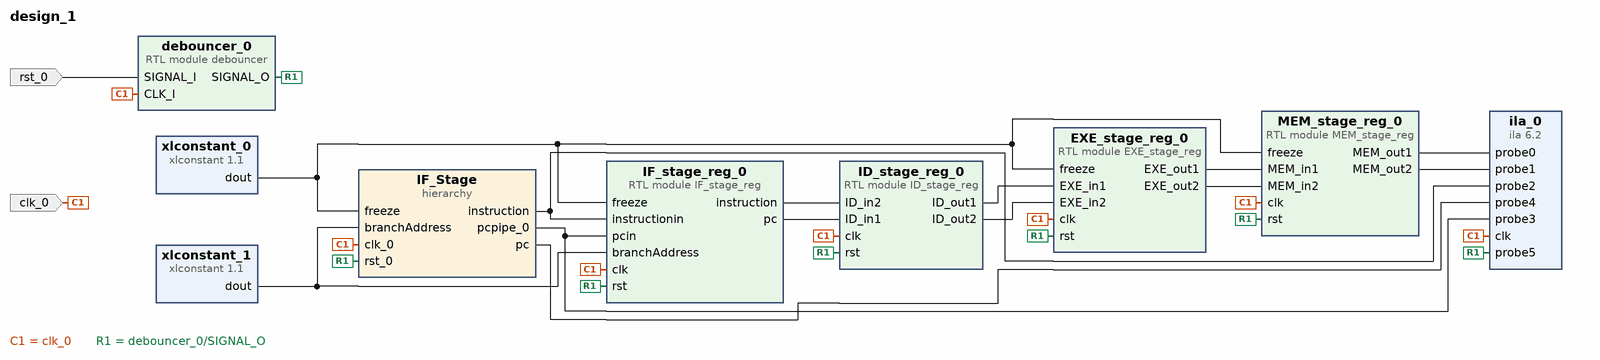
[diagram p0: block diagram of the top level]
# Vivado block design design_1, xc7z010clg400-1, Vivado 2018.3
create_bd_design design_1

create_bd_port -dir I -type clk clk_0
create_bd_port -dir I -type rst rst_0

create_bd_cell -type ip -vlnv xilinx.com:ip:xlconstant:1.1 xlconstant_0
set_property -dict {CONFIG.CONST_VAL 0} [get_bd_cells xlconstant_0]
create_bd_cell -type ip -vlnv xilinx.com:ip:xlconstant:1.1 xlconstant_1
set_property -dict {CONFIG.CONST_VAL 0 CONFIG.CONST_WIDTH 32} [get_bd_cells xlconstant_1]
create_bd_cell -type module -reference IF_stage_reg IF_stage_reg_0
create_bd_cell -type hier IF_Stage
create_bd_cell -type module -reference ID_stage_reg ID_stage_reg_0
create_bd_cell -type module -reference EXE_stage_reg EXE_stage_reg_0
create_bd_cell -type module -reference MEM_stage_reg MEM_stage_reg_0
create_bd_cell -type ip -vlnv xilinx.com:ip:ila:6.2 ila_0
set_property -dict [list \
  CONFIG.C_ENABLE_ILA_AXI_MON false \
  CONFIG.C_MONITOR_TYPE Native \
  CONFIG.C_NUM_OF_PROBES 6 \
  CONFIG.C_PROBE0_TYPE 1 \
  CONFIG.C_PROBE0_WIDTH 32 \
  CONFIG.C_PROBE1_TYPE 1 \
  CONFIG.C_PROBE1_WIDTH 32 \
  CONFIG.C_PROBE2_TYPE 1 \
  CONFIG.C_PROBE2_WIDTH 32 \
  CONFIG.C_PROBE3_TYPE 1 \
  CONFIG.C_PROBE3_WIDTH 32 \
  CONFIG.C_PROBE4_TYPE 1 \
  CONFIG.C_PROBE4_WIDTH 32 \
  CONFIG.C_PROBE5_TYPE 2 \
] [get_bd_cells ila_0]
create_bd_cell -type module -reference debouncer debouncer_0

# ---- hierarchy /IF_Stage ----
current_bd_instance /IF_Stage
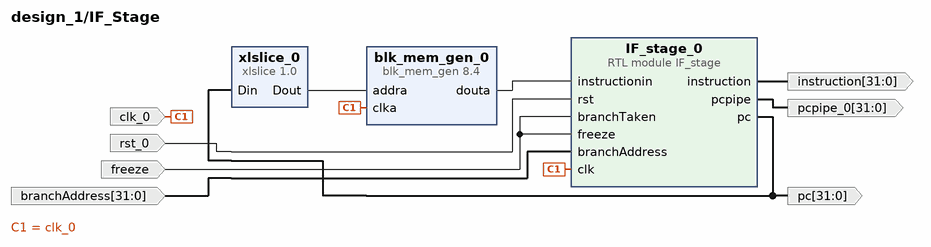
[diagram p1: block diagram inside /IF_Stage]
create_bd_pin -dir O -from 31 -to 0 pc
create_bd_pin -dir I -type clk clk_0
create_bd_pin -dir I -type rst rst_0
create_bd_pin -dir I freeze
create_bd_pin -dir I -from 31 -to 0 branchAddress
create_bd_pin -dir O -from 31 -to 0 instruction
create_bd_pin -dir O -from 31 -to 0 pcpipe_0

create_bd_cell -type ip -vlnv xilinx.com:ip:xlslice:1.0 xlslice_0
set_property -dict {CONFIG.DIN_FROM 12 CONFIG.DOUT_WIDTH 13} [get_bd_cells xlslice_0]
create_bd_cell -type ip -vlnv xilinx.com:ip:blk_mem_gen:8.4 blk_mem_gen_0
set_property -dict [list \
  CONFIG.Coe_File ../../../../../../../output.coe \
  CONFIG.Enable_32bit_Address false \
  CONFIG.Enable_A Always_Enabled \
  CONFIG.Fill_Remaining_Memory_Locations true \
  CONFIG.Load_Init_File true \
  CONFIG.Memory_Type Single_Port_ROM \
  CONFIG.Port_A_Write_Rate 0 \
  CONFIG.Register_PortA_Output_of_Memory_Primitives true \
  CONFIG.Remaining_Memory_Locations FABC \
  CONFIG.Use_RSTA_Pin false \
  CONFIG.use_bram_block Stand_Alone \
] [get_bd_cells blk_mem_gen_0]
create_bd_cell -type module -reference IF_stage IF_stage_0

# ---- connections ----

current_bd_instance /IF_Stage
connect_bd_net [get_bd_pins xlslice_0/Dout] [get_bd_pins blk_mem_gen_0/addra]
connect_bd_net [get_bd_pins IF_stage_0/pc] [get_bd_pins pc] [get_bd_pins xlslice_0/Din]
connect_bd_net -net clk_0_1 [get_bd_pins clk_0] [get_bd_pins blk_mem_gen_0/clka] [get_bd_pins IF_stage_0/clk]
connect_bd_net -net rst_0_1 [get_bd_pins rst_0] [get_bd_pins IF_stage_0/rst]
connect_bd_net -net xlconstant_0_dout [get_bd_pins freeze] [get_bd_pins IF_stage_0/branchTaken] [get_bd_pins IF_stage_0/freeze]
connect_bd_net [get_bd_pins blk_mem_gen_0/douta] [get_bd_pins IF_stage_0/instructionin]
connect_bd_net -net xlconstant_1_dout [get_bd_pins branchAddress] [get_bd_pins IF_stage_0/branchAddress]
connect_bd_net [get_bd_pins IF_stage_0/instruction] [get_bd_pins instruction]
connect_bd_net [get_bd_pins IF_stage_0/pcpipe] [get_bd_pins pcpipe_0]

current_bd_instance /
connect_bd_net -net IF_stage_0_pc [get_bd_pins IF_Stage/pc] [get_bd_pins ila_0/probe4]
connect_bd_net -net IF_stage_0_instruction [get_bd_pins IF_Stage/instruction] [get_bd_pins IF_stage_reg_0/instructionin] [get_bd_pins ila_0/probe2]
connect_bd_net [get_bd_pins IF_stage_reg_0/instruction] [get_bd_pins ID_stage_reg_0/ID_in2]
connect_bd_net [get_bd_pins ID_stage_reg_0/ID_out1] [get_bd_pins EXE_stage_reg_0/EXE_in1]
connect_bd_net [get_bd_pins ID_stage_reg_0/ID_out2] [get_bd_pins EXE_stage_reg_0/EXE_in2]
connect_bd_net [get_bd_pins EXE_stage_reg_0/EXE_out1] [get_bd_pins MEM_stage_reg_0/MEM_in1]
connect_bd_net [get_bd_pins EXE_stage_reg_0/EXE_out2] [get_bd_pins MEM_stage_reg_0/MEM_in2]
connect_bd_net -net clk_0_1 [get_bd_ports clk_0] \
  [get_bd_pins IF_stage_reg_0/clk] [get_bd_pins IF_Stage/clk_0] [get_bd_pins ID_stage_reg_0/clk] \
  [get_bd_pins EXE_stage_reg_0/clk] [get_bd_pins MEM_stage_reg_0/clk] [get_bd_pins ila_0/clk] [get_bd_pins debouncer_0/CLK_I]
connect_bd_net -net rst_0_1 [get_bd_pins debouncer_0/SIGNAL_O] \
  [get_bd_pins IF_stage_reg_0/rst] [get_bd_pins IF_Stage/rst_0] [get_bd_pins ID_stage_reg_0/rst] \
  [get_bd_pins EXE_stage_reg_0/rst] [get_bd_pins MEM_stage_reg_0/rst] [get_bd_pins ila_0/probe5]
connect_bd_net [get_bd_pins xlconstant_0/dout] \
  [get_bd_pins IF_stage_reg_0/freeze] [get_bd_pins IF_Stage/freeze] [get_bd_pins EXE_stage_reg_0/freeze] \
  [get_bd_pins MEM_stage_reg_0/freeze]
connect_bd_net [get_bd_pins MEM_stage_reg_0/MEM_out1] [get_bd_pins ila_0/probe0]
connect_bd_net [get_bd_pins MEM_stage_reg_0/MEM_out2] [get_bd_pins ila_0/probe1]
connect_bd_net [get_bd_pins xlconstant_1/dout] [get_bd_pins IF_stage_reg_0/branchAddress] [get_bd_pins IF_Stage/branchAddress]
connect_bd_net [get_bd_pins IF_stage_reg_0/pc] [get_bd_pins ID_stage_reg_0/ID_in1]
connect_bd_net [get_bd_pins IF_Stage/pcpipe_0] [get_bd_pins IF_stage_reg_0/pcin] [get_bd_pins ila_0/probe3]
connect_bd_net -net rst_0_2 [get_bd_ports rst_0] [get_bd_pins debouncer_0/SIGNAL_I]

validate_bd_design
save_bd_design
